# Altium project Transmitter.PrjPcb
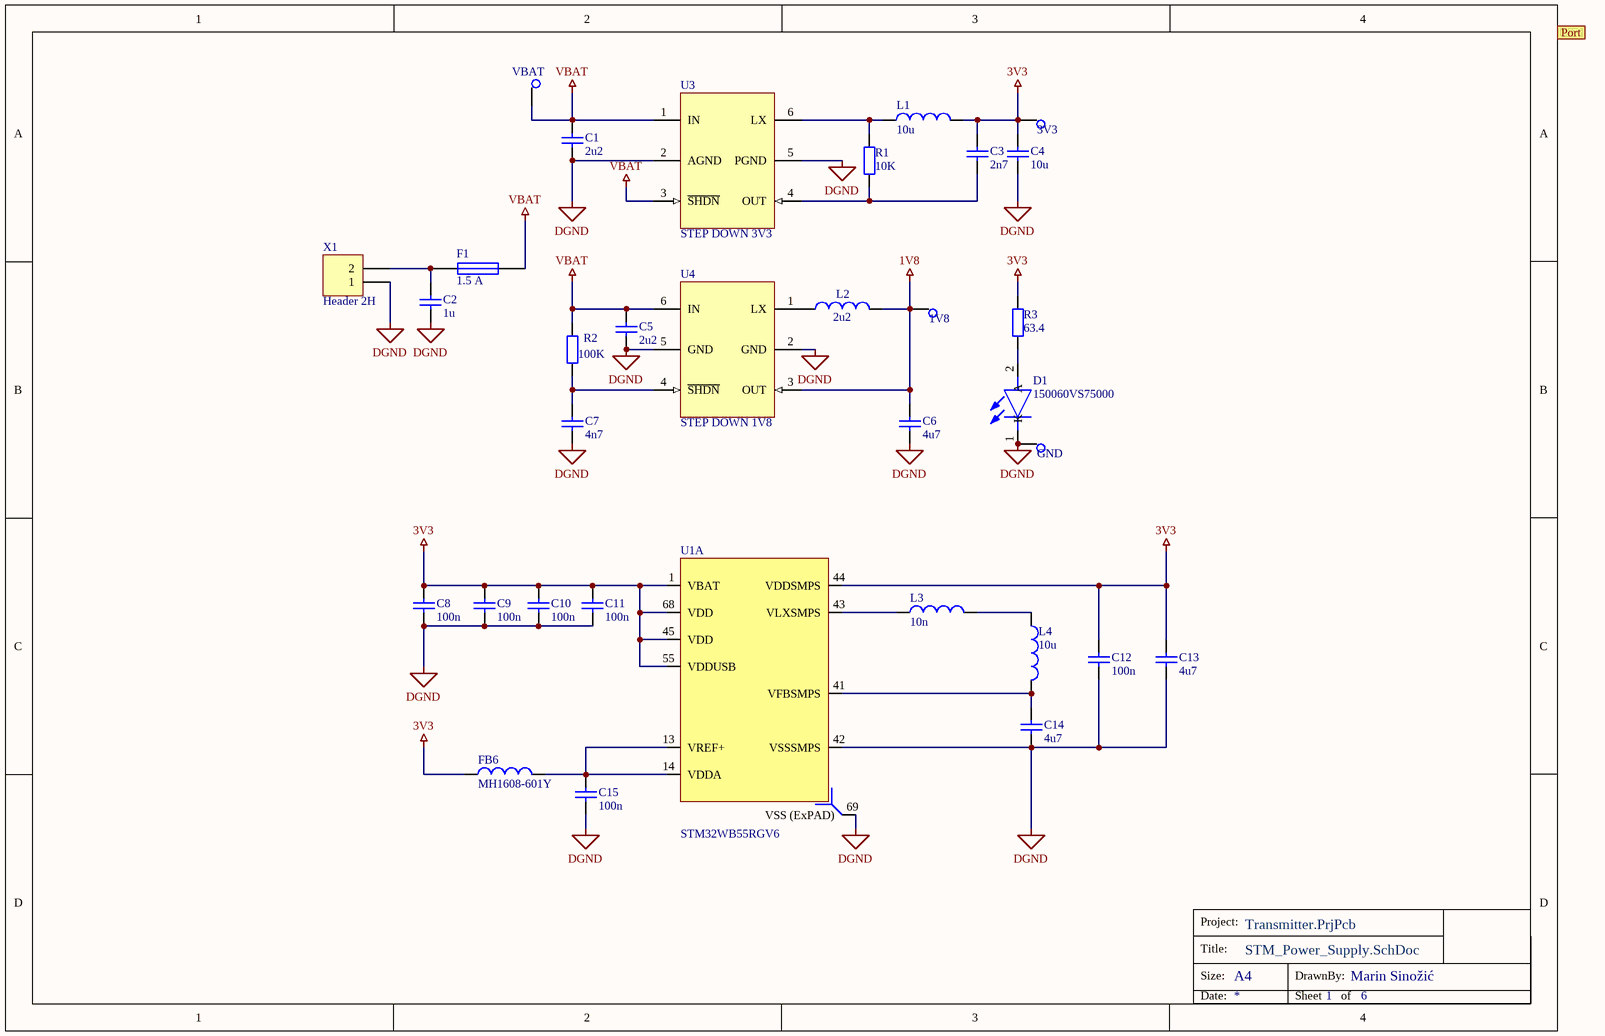
[diagram p0: STM_Power_Supply.SchDoc]
6 sheets, 129 parts. Net scope: global (net labels, ports and power ports of the same name join across sheets).
Board file: Transmitter.PcbDoc
Sheets:
  STM_Power_Supply.SchDoc
  STM_Bluetooth.SchDoc
  STM_DDS_GPIO.SchDoc
  DDS_Power_Supply.SchDoc
  DDS_Out.SchDoc
  Mechanical.SchDoc

## Sheet STM_Power_Supply.SchDoc: STM Power Supply
size A4; DrawnBy: Marin Sinožić; Organization: Altium Limited; Address1: L3, 12a Rodborough Rd; Address2: Frenchs Forest; Address3: NSW; Address4: Australia 2086; SheetNumber: 1; SheetTotal: 6

### Parts
1V8  TestPoint  [TP]  (value not drawn)
3V3  TestPoint  [TP]  (value not drawn)
C1  2u2  [0603]
C2  1u  [0805]
C3  2n7  [0603]
C4  10u  [0603]
C5  2u2  [0603]
C6  4u7  [0603]
C7  4n7  [0603]
C8  100n  [0603]
C9  100n  [0603]
C10  100n  [0603]
C11  100n  [0603]
C12  100n  [0603]
C13  4u7  [0603]
C14  4u7  [0603]
C15  100n  [0603]
D1  150060VS75000  [0603]
F1  1.5 A  [MF-USMF075-2]
FB6  MH1608-601Y  [0603]
GND  TestPoint  [TP]  (value not drawn)
L1  10u  [IND_10uH]
L2  2u2  [INDP2929X15N]
L3  10n  [0603]
L4  10u  [0805]
R1  10K  [0603]
R2  100K  [0603]
R3  63.4  [0603]
U1  STM32WB55RGV6  [VFQFPN69]  (part A of 3)
U3  STEP DOWN 3V3  [SOT95P280X145-6N]
U4  STEP DOWN 1V8  [SC70P20X21]
VBAT  TestPoint  [TP]  (value not drawn)
X1  Header 2H  [HDR1X2]

### Ports
Port

### Nets
1V8: 1V8.1 C6.2 L2.1 U4.3(OUT)
3V3: 3V3.1 C3.2 C4.2 C8.2 C9.2 C10.2 C11.2 C12.2 C13.1 FB6.1 L1.2 R3.2 U1.1(VBAT) U1.44(VDDSMPS) U1.45(VDD) U1.55(VDDUSB) U1.68(VDD)
DGND: C1.1 C2.1 C4.1 C5.1 C6.1 C7.1 C8.1 C9.1 C10.1 C11.1 C12.1 C13.2 C14.1 C15.1 D1.1(K) GND.1 U1.42(VSSSMPS) U1.69(VSS_(ExPAD)) U3.2(AGND) U3.5(PGND) U4.2(GND) U4.5(GND) X1.1
VBAT: C1.2 C5.2 F1.2 R2.2 U3.1(IN) U3.3(~{SHDN}) U4.6(IN) VBAT.1
NetC2_2: C2.2 F1.1 X1.2
NetC3_1: C3.1 R1.1 U3.4(OUT)
NetC7_2: C7.2 R2.1 U4.4(~{SHDN})
NetC14_2: C14.2 L4.2 U1.41(VFBSMPS)
NetC15_2: C15.2 FB6.2 U1.13(VREF+) U1.14(VDDA)
NetD1_2: D1.2(A) R3.1
NetL1_1: L1.1 R1.2 U3.6(LX)
NetL2_2: L2.2 U4.1(LX)
NetL3_1: L3.1 U1.43(VLXSMPS)
NetL3_2: L3.2 L4.1

### Notes on the sheet
- Project:
- Title:
- Size:
- A4
- DrawnBy:
- Date:
- Sheet
- of

### Library data of the parts
C1 C5 = Cap: CAP CER 2.2UF 25V X5R 0603; Manufacturer Part Number: 490-10731-1-ND; Value: 2u2; Supplier 1: Digi-Key; Price: 0.16
C2 = Cap: CAP CER 1UF 25V X5R 0805; Manufacturer Part Number: 311-1868-1-ND; Value: 1u; Supplier 1: Digi-Key; Price: 0.21
C3 = Cap: CAP CER 2700PF 50V X7R 0603; Manufacturer Part Number: 1276-2022-1-ND; Value: 2n7; Supplier 1: Digi-Key; Price: 0.1
C4 = Cap: CAP CER 10UF 25V X5R 0603; Manufacturer Part Number: 490-GRM188R61E106KA73JCT-ND; Value: 10u; Supplier 1: Digi-Key; Price: 0.32
C6 C13 C14 = Cap: CAP CER 4.7UF 16V X5R 0603; Manufacturer Part Number: 587-2786-1-ND; Value: 4u7; Supplier 1: Digi-Key; Price: 0.32
C7 = Cap: CAP CER 4700PF 50V X7R 0603; Manufacturer Part Number: 1276-1098-1-ND; Value: 4n7; Supplier 1: Digi-Key; Price: 0.1
C8-C12 C15 = Cap: CAP CER 0.1UF 50V X7R 0603; Manufacturer Part Number: 1276-CL10B104KB8WPNDCT-ND; Value: 100n; Supplier 1: Digi-Key; Price: 0.1
D1 = 150060VS75000: LED GREEN DIFFUSED 0603 SMD; Manufacturer Part Number: 732-12017-1-ND; Price: 0.18; Value: *; Supplier 1: Digi-Key
F1 = Fuse 1: PTC RESET FUSE 6V 750MA 1210; Manufacturer Part Number: MF-USMF075-2CT-ND; Price: 0.67; Supplier 1: Digi-Key
FB6 = MH1608-601Y: FERRITE BEAD 600 OHM 0603 1LN; Manufacturer Part Number: MH1608-601YCT-ND; Supplier 1: Digi-Key; Price: 0.1
L1 = L_0805_10uH: FIXED IND 10UH 550MA 210MOHM SMD; Manufacturer Part Number: 308-2298-1-ND; Supplier 1: Digi-Key; Value: 10u; Price: 1.23
L2 = L_0805_10uH: FIXED IND 2.2UH 1.22A 78MOHM SMD; Manufacturer Part Number: 490-15950-1-ND; Supplier 1: Digi-Key; Value: 2u2; Price: 0.36
L3 = L_0805_10uH: FIXED IND 10NH 600MA 200MOHM SMD; Manufacturer Part Number: 490-15244-1-ND; Supplier 1: Digi-Key; Value: 10n; Price: 0.14
L4 = L_0805_10uH: FIXED IND 10UH 100MA 780MOHM SMD; Manufacturer Part Number: 490-4029-1-ND; Supplier 1: Digi-Key; Value: 10u; Price: 0.25
R1 = Res2: RES SMD 10K OHM 0.5% 1/5W 0603; Manufacturer Part Number: P20397CT-ND; Value: 10K; Supplier 1: Digi-Key; Price: 0.16
R2 = Res2: RES 100 KOHMS 0.5% 1/10W 0603; Manufacturer Part Number: P123902CT-ND; Value: 100K; Supplier 1: Digi-Key; Price: 0.11
R3 = Res2: RES SMD 63.4 OHM 0.1% 1/10W 0603; Manufacturer Part Number: YAG4584CT-ND; Value: 63.4; Supplier 1: Digi-Key; Price: 0.32
U1 = STM32WB55RGV6: MCU 32-Bit STM32WB55 ARM Cortex M4 RISC 1MB Flash 1.7V to 3.6V 68-Pin VFQFPN Tray; Manufacturer Part Number: 497-18488-ND; Price: 11.67; Supplier 1: Digi-Key
U3 = MAX1921EUT33+T: IC REG BUCK 3.3V 400MA SOT23-6; Manufacturer Part Number: MAX1921EUT33+T-ND; Price: 3.34; Supplier 1: Digi-Key
U4 = MAX8640YEXT18+T: IC REG BUCK 1.8V 500MA SC70-6; Manufacturer Part Number: MAX8640YEXT18+TCT-ND; Price: 4.69; Supplier 1: Digi-Key
X1 = Header 2H: Header, 2-Pin, Right Angle

## Sheet STM_Bluetooth.SchDoc
size A4; DrawnBy: Marin Sinožić; SheetNumber: 2; SheetTotal: 6
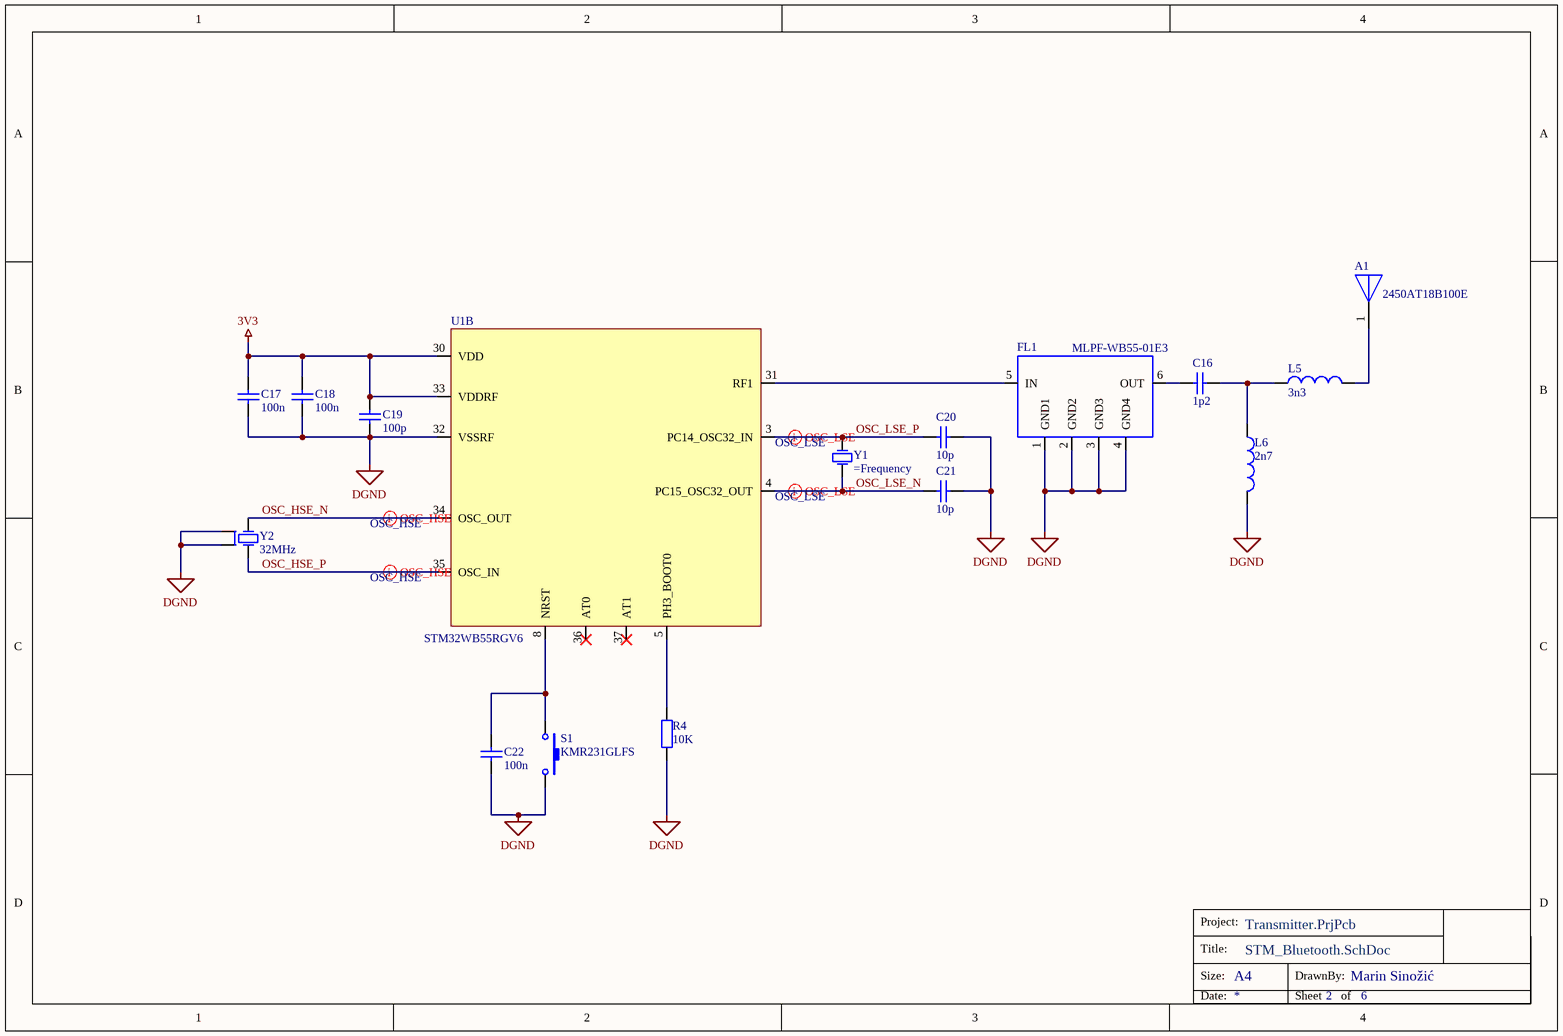
[diagram p1: STM_Bluetooth.SchDoc]

### Parts
A1  2450AT18B100E  [ANT_2450AT18B100E]
C16  1p2  [0402]
C17  100n  [0603]
C18  100n  [0603]
C19  100p  [0603]
C20  10p  [0603]
C21  10p  [0603]
C22  100n  [0603]
FL1  MLPF-WB55-01E3  [CSP_BUMPLESS]
L5  3n3  [0402]
L6  2n7  [0402]
R4  10K  [0603]
S1  KMR231GLFS  [SW-PB SMD KMR2]
U1  STM32WB55RGV6  [Model Name]  (part B of 3)
Y1  (no value)  [NX2012_2P]
Y2  32MHz  [NX2016_4P]

### Nets
3V3: C17.2 C18.2 C19.2 U1.30(VDD) U1.33(VDDRF)
DGND: C17.1 C18.1 C19.1 C20.2 C21.2 C22.1 FL1.1(GND1) FL1.2(GND2) FL1.3(GND3) FL1.4(GND4) L6.2 R4.1 S1.2 U1.32(VSSRF) Y2.2 Y2.4
OSC_HSE_N: U1.34(OSC_OUT) Y2.1(OSC1)
OSC_HSE_P: U1.35(OSC_IN) Y2.3(OSC2)
OSC_LSE_N: C21.1 U1.4(PC15_OSC32_OUT) Y1.1(OSC1)
OSC_LSE_P: C20.1 U1.3(PC14_OSC32_IN) Y1.2(OSC2)
NetA1_1: A1.1 L5.2
NetC16_1: C16.1 L5.1 L6.1
NetC16_2: C16.2 FL1.6(OUT)
NetC22_2: C22.2 S1.1 U1.8(NRST)
NetFL1_5: FL1.5(IN) U1.31(RF1)
NetR4_2: R4.2 U1.5(PH3_BOOT0)

Not connected (* = marked no-connect by the designer): U1 36(AT0)* 37(AT1)*

### Layout directives
differential pair; differential pair class OSC_LSE; net class *: OSC_LSE_P
differential pair; differential pair class OSC_LSE: OSC_LSE_N
differential pair; differential pair class OSC_HSE: OSC_HSE_N
differential pair; differential pair class OSC_HSE; differential pair class OSC_HSE: OSC_HSE_P

### Notes on the sheet
- Project:
- Title:
- Size:
- A4
- DrawnBy:
- Date:
- Sheet
- of

### Library data of the parts
A1 = BT_ANTENNA: RF ANT 2.4GHZ CHIP SOLDER SMD; Manufacturer Part Number: 712-1006-1-ND; Supplier 1: Digi-Key; Price: 0.56
C16 = Cap: CAP CER 1.2PF 50V C0G/NP0 0402; Manufacturer Part Number: 712-1268-1-ND; Value: 1p2; Supplier 1: Digi-Key; Price: 0.18
C17 C18 C22 = Cap: as C8 on sheet STM_Power_Supply; Value: 100n; Supplier 1: Digi-Key; Price: 0.1
C19 = Cap: CAP CER 100PF 50V X7R 0603; Manufacturer Part Number: 1276-1908-1-ND; Value: 100p; Supplier 1: Digi-Key; Price: 0.1
C20 C21 = Cap: CAP CER 10PF 50V X7R 0603; Manufacturer Part Number: 399-C0603C100J5RAC7867CT-ND; Value: 10p; Supplier 1: Digi-Key; Price: 0.25
FL1 = FLT_2.4GHz: RF Filter Low Pass 2400MHz to 2500MHz 1.1dB 50Ohm SMD 6Pin T/R; Supplier 1: Digi-Key; Manufacturer Part Number: MLPF-WB55-01E3; Price: 0.39
L5 = L_0805_10uH: FIXED IND 3.3NH 300MA 190MOHM SM; Manufacturer Part Number: 712-1416-1-ND; Supplier 1: Digi-Key; Value: 3n3; Price: 0.1
L6 = L_0805_10uH: FIXED IND 2.7NH 300MA 170MOHM SM; Manufacturer Part Number: 712-1415-1-ND; Supplier 1: Digi-Key; Value: 2n7; Price: 0.1
R4 = Res2: as R1 on sheet STM_Power_Supply; Value: 10K; Supplier 1: Digi-Key; Price: 0.16
S1 = SW-PB: Switch Tactile N.O. SPST Button Gull Wing 0.05A 32VDC 1VA 150000Cycles 3N SMD T/R; Manufacturer Part Number: 1437636; Supplier 1: Farnell; Price: 0,49
U1 = STM32WB55RGV6: MCU 32-Bit STM32WB55 ARM Cortex M4 RISC 1MB Flash 1.7V to 3.6V 68-Pin VFQFPN Tray
Y1 = OSC_LFXTAL073170_32.768kHz: NDK 32.76kHz Crystal Unit ±20ppm SMD 2-Pin 2.05 x 1.2 x 0.55mm; Manufacturer Part Number: 644-1219-1-ND; Supplier 1: Digi-Key; Price: 0.91
Y2 = OSC_LFXTAL073170_32MHz: Crystal 32.0MHZ 10PF SMD Esr 60; Manufacturer Part Number: 1923-1603-1-ND; Supplier 1: Digi-Key; Price: 0.66

## Sheet STM_DDS_GPIO.SchDoc: STM DDS GPIO
size A4; DrawnBy: Marin Sinožić; SheetNumber: 3; SheetTotal: 6
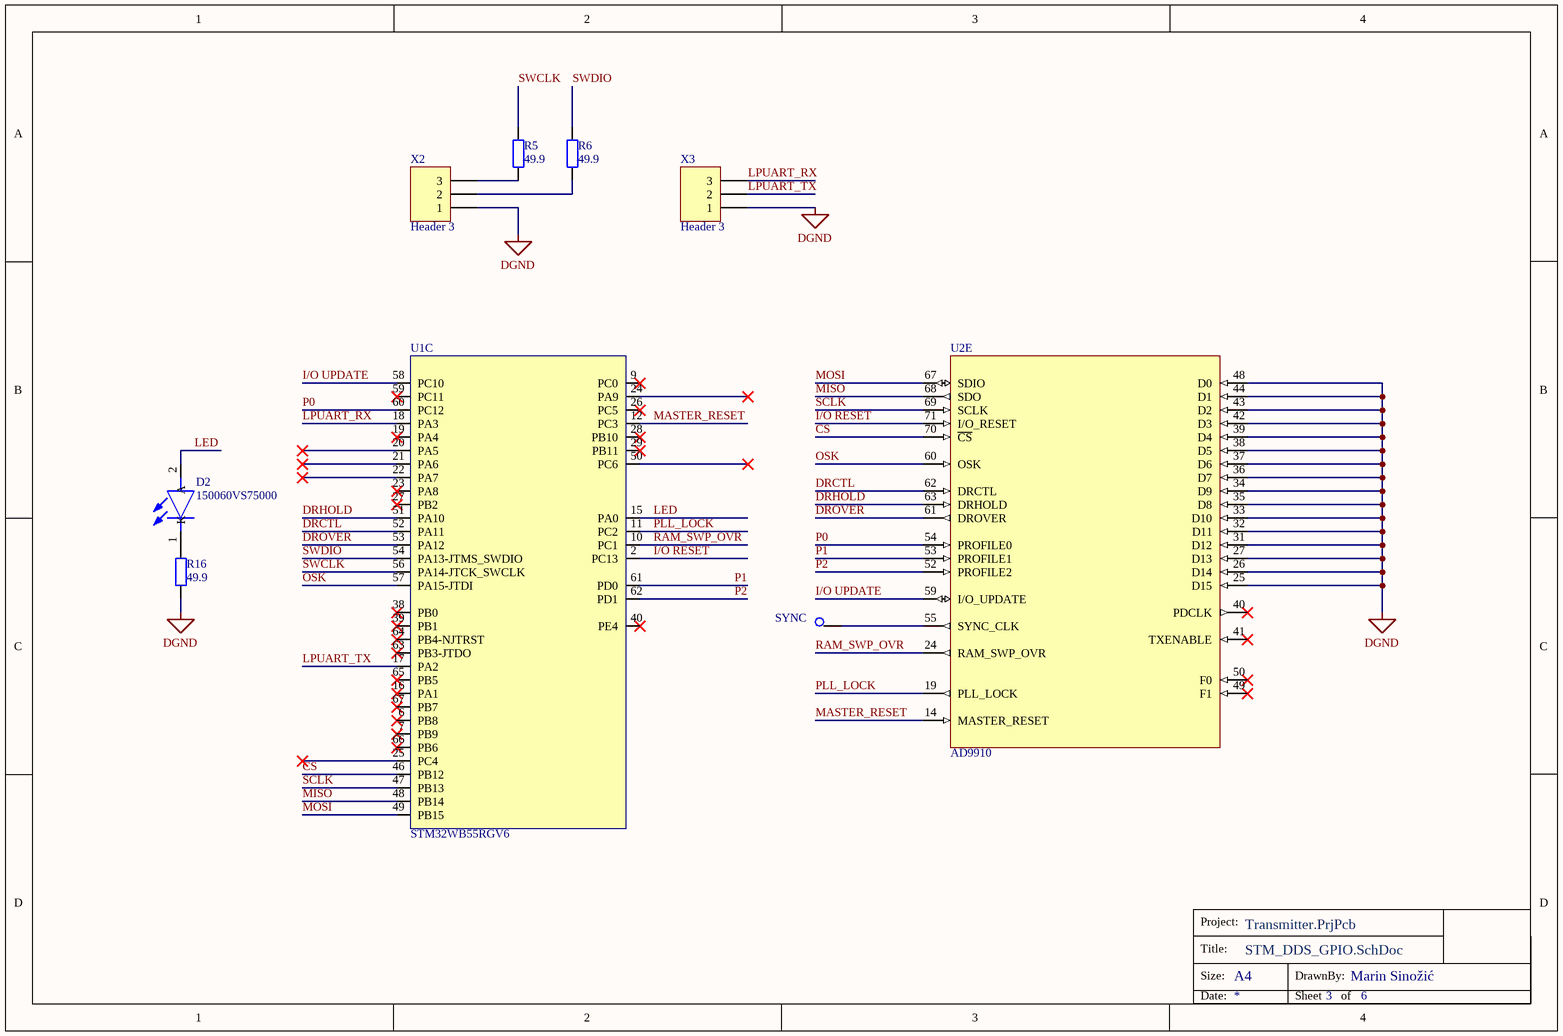
[diagram p2: STM_DDS_GPIO.SchDoc]

### Parts
D2  150060VS75000  [0603]
R5  49.9  [0805]
R6  49.9  [0805]
R16  49.9  [0805]
SYNC  TestPoint  [TP]  (value not drawn)
U1  STM32WB55RGV6  [VFQFPN69]  (part C of 3)
U2  AD9910  [TSQFP50P1600X1600X105_HS-101N]  (part E of 5)
X2  Header 3  [HDR1X3]
X3  Header 3  [HDR1X3]

### Nets
DGND: R16.2 U2.25(D15) U2.26(D14) U2.27(D13) U2.31(D12) U2.32(D11) U2.33(D10) U2.34(D9) U2.35(D8) U2.36(D7) U2.37(D6) U2.38(D5) U2.39(D4) U2.42(D3) U2.43(D2) U2.44(D1) U2.48(D0) X2.1 X3.1
~{CS}: U1.46(PB12) U2.70(~{CS})
DRCTL: U1.52(PA11) U2.62(DRCTL)
DRHOLD: U1.51(PA10) U2.63(DRHOLD)
DROVER: U1.53(PA12) U2.61(DROVER)
I/O RESET: U1.2(PC13) U2.71(I/O_RESET)
I/O UPDATE: U1.58(PC10) U2.59(I/O_UPDATE)
LED: D2.2(A) U1.15(PA0)
LPUART_RX: U1.18(PA3) X3.3
LPUART_TX: U1.17(PA2) X3.2
MASTER_RESET: U1.12(PC3) U2.14(MASTER_RESET)
MISO: U1.48(PB14) U2.68(SDO)
MOSI: U1.49(PB15) U2.67(SDIO)
OSK: U1.57(PA15-JTDI) U2.60(OSK)
P0: U1.60(PC12) U2.54(PROFILE0)
P1: U1.61(PD0) U2.53(PROFILE1)
P2: U1.62(PD1) U2.52(PROFILE2)
PLL_LOCK: U1.11(PC2) U2.19(PLL_LOCK)
RAM_SWP_OVR: U1.10(PC1) U2.24(RAM_SWP_OVR)
SCLK: U1.47(PB13) U2.69(SCLK)
SWCLK: R5.1 U1.56(PA14-JTCK_SWCLK)
SWDIO: R6.1 U1.54(PA13-JTMS_SWDIO)
NetD2_1: D2.1(K) R16.1
NetR5_2: R5.2 X2.3
NetR6_2: R6.2 X2.2
NetSYNC_1: SYNC.1 U2.55(SYNC_CLK)

Not connected (* = marked no-connect by the designer): U1 6(PB8)* 7(PB9)* 9(PC0)* 16(PA1)* 19(PA4)* 20(PA5)* 21(PA6)* 22(PA7)* 23(PA8)* 24(PA9)* 25(PC4)* 26(PC5)* 27(PB2)* 28(PB10)* 29(PB11)* 38(PB0)* 39(PB1)* 40(PE4)* 50(PC6)* 59(PC11)* 63(PB3-JTDO)* 64(PB4-NJTRST)* 65(PB5)* 66(PB6)* 67(PB7)*; U2 40(PDCLK)* 41(TXENABLE)* 49(F1)* 50(F0)*

### Notes on the sheet
- Project:
- Title:
- Size:
- A4
- DrawnBy:
- Date:
- Sheet
- of

### Library data of the parts
D2 = 150060VS75000: as D1 on sheet STM_Power_Supply; Price: 0.18; Value: *; Supplier 1: Digi-Key
R5 R6 R16 = Res2: RES SMD 49.9 OHM 0.1% 1/10W 0603; Manufacturer Part Number: P49.9DBCT-ND; Value: 49.9; Supplier 1: Digi-Key; Price: 0.32
U1 = STM32WB55RGV6: as U1 on sheet STM_Power_Supply; Price: 11.67; Supplier 1: Digi-Key
U2 = AD9910BSVZ: ANALOG DEVICES - AD9910BSVZ - Direct Digital Synthesizer, 1 GSPS. 14 Bit, 3.3 V,; Manufacturer Part Number: 505-AD9910BSVZ-ND; Price: 72.64; Supplier 1: Digi-Key
X2 X3 = Header 3: Header, 3-Pin

## Sheet DDS_Power_Supply.SchDoc
size A4; DrawnBy: Marin Sinožić; SheetNumber: 4; SheetTotal: 6
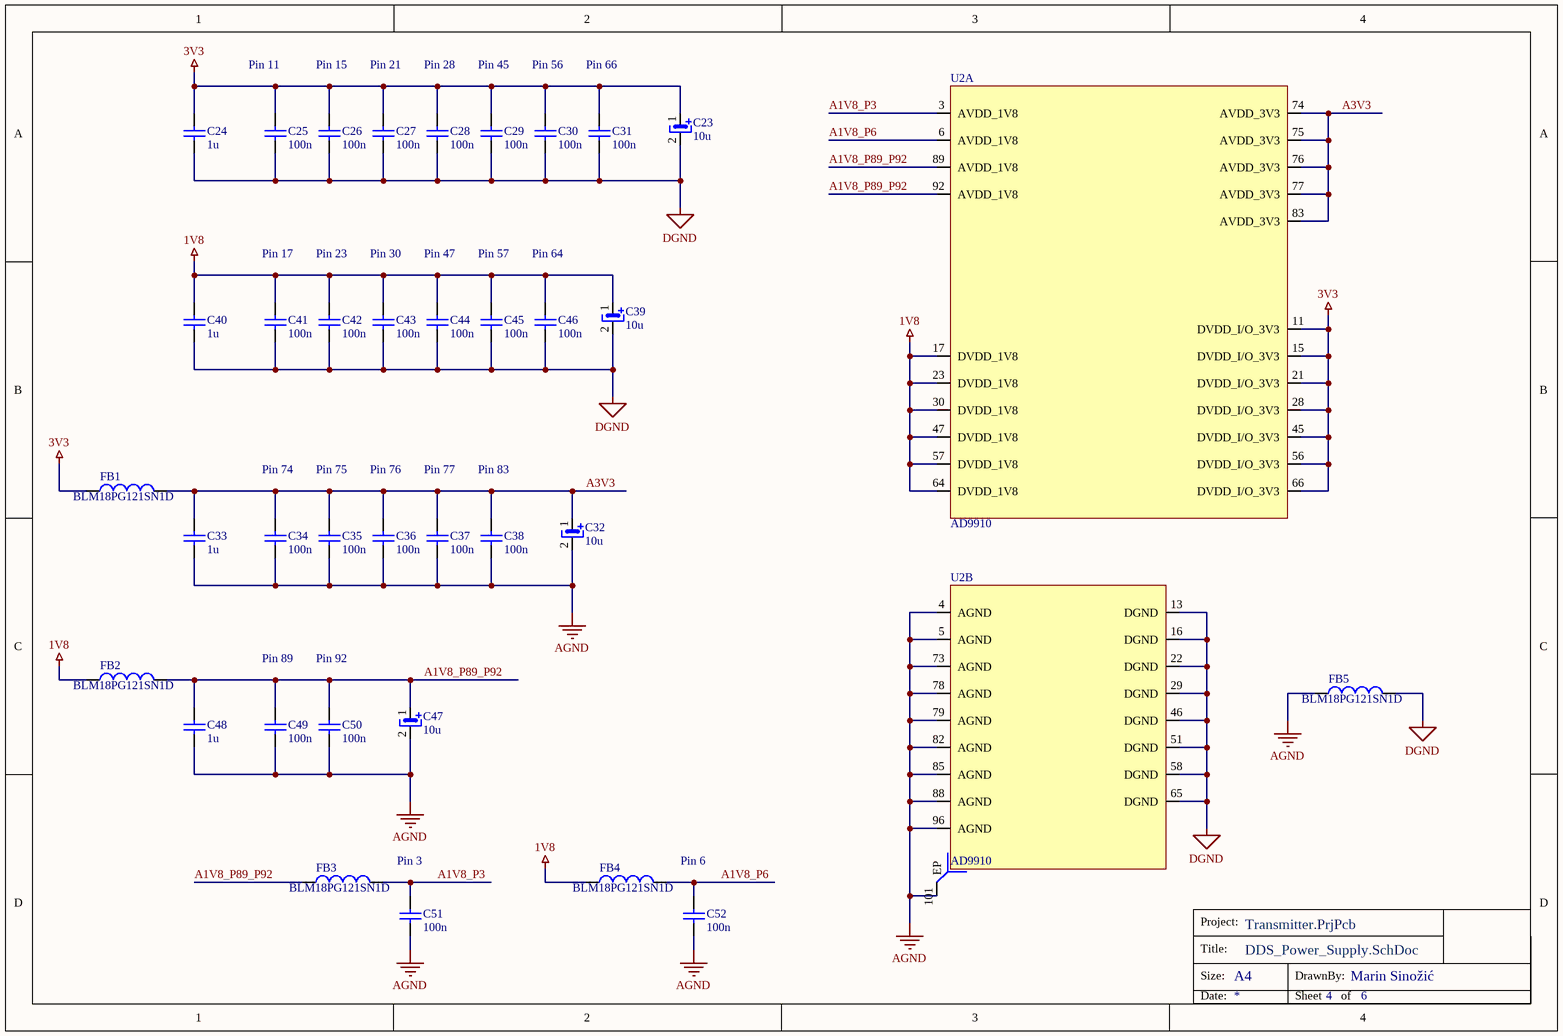
[diagram p3: DDS_Power_Supply.SchDoc]

### Parts
C23  10u  [0805]
C24  1u  [0805]
C25  100n  [0603]
C26  100n  [0603]
C27  100n  [0603]
C28  100n  [0603]
C29  100n  [0603]
C30  100n  [0603]
C31  100n  [0603]
C32  10u  [0805]
C33  1u  [0805]
C34  100n  [0603]
C35  100n  [0603]
C36  100n  [0603]
C37  100n  [0603]
C38  100n  [0603]
C39  10u  [0805]
C40  1u  [0805]
C41  100n  [0603]
C42  100n  [0603]
C43  100n  [0603]
C44  100n  [0603]
C45  100n  [0603]
C46  100n  [0603]
C47  10u  [0805]
C48  1u  [0805]
C49  100n  [0603]
C50  100n  [0603]
C51  100n  [0603]
C52  100n  [0603]
FB1  BLM18PG121SN1D  [0603]
FB2  BLM18PG121SN1D  [0603]
FB3  BLM18PG121SN1D  [0603]
FB4  BLM18PG121SN1D  [0603]
FB5  BLM18PG121SN1D  [0603]
U2  AD9910  [TSQFP50P1600X1600X105_HS-101N]  (parts A,B of 5)

### Nets
1V8: C39.1(+) C40.2 C41.2 C42.2 C43.2 C44.2 C45.2 C46.2 FB2.1 FB4.1 U2.17(DVDD_1V8) U2.23(DVDD_1V8) U2.30(DVDD_1V8) U2.47(DVDD_1V8) U2.57(DVDD_1V8) U2.64(DVDD_1V8)
3V3: C23.1(+) C24.2 C25.2 C26.2 C27.2 C28.2 C29.2 C30.2 C31.2 FB1.1 U2.11(DVDD_I/O_3V3) U2.15(DVDD_I/O_3V3) U2.21(DVDD_I/O_3V3) U2.28(DVDD_I/O_3V3) U2.45(DVDD_I/O_3V3) U2.56(DVDD_I/O_3V3) U2.66(DVDD_I/O_3V3)
AGND: C32.2(-) C33.1 C34.1 C35.1 C36.1 C37.1 C38.1 C47.2(-) C48.1 C49.1 C50.1 C51.1 C52.1 FB5.1 U2.4(AGND) U2.5(AGND) U2.73(AGND) U2.78(AGND) U2.79(AGND) U2.82(AGND) U2.85(AGND) U2.88(AGND) U2.96(AGND) U2.101(EP)
DGND: C23.2(-) C24.1 C25.1 C26.1 C27.1 C28.1 C29.1 C30.1 C31.1 C39.2(-) C40.1 C41.1 C42.1 C43.1 C44.1 C45.1 C46.1 FB5.2 U2.13(DGND) U2.16(DGND) U2.22(DGND) U2.29(DGND) U2.46(DGND) U2.51(DGND) U2.58(DGND) U2.65(DGND)
A1V8_P3: C51.2 FB3.2 U2.3(AVDD_1V8)
A1V8_P6: C52.2 FB4.2 U2.6(AVDD_1V8)
A1V8_P89_P92: C47.1(+) C48.2 C49.2 C50.2 FB2.2 FB3.1 U2.89(AVDD_1V8) U2.92(AVDD_1V8)
A3V3: C32.1(+) C33.2 C34.2 C35.2 C36.2 C37.2 C38.2 FB1.2 U2.74(AVDD_3V3) U2.75(AVDD_3V3) U2.76(AVDD_3V3) U2.77(AVDD_3V3) U2.83(AVDD_3V3)

### Notes on the sheet
- Pin 11
- Pin 15
- Pin 21
- Pin 28
- Pin 45
- Pin 56
- Pin 66
- Pin 17
- Pin 23
- Pin 30
- Pin 47
- Pin 57
- Pin 64
- Pin 74
- Pin 75
- Pin 76
- Pin 77
- Pin 83
- Pin 89
- Pin 92
- Pin 3
- Pin 6
- Project:
- Title:
- Size:
- A4
- DrawnBy:
- Date:
- Sheet
- of

### Library data of the parts
C23 C32 C39 C47 = C_TANT_10uF: CAP TANT 10UF 20% 10V 0805; Manufacturer Part Number: 718-2490-1-ND; Supplier 1: Digi-Key; Capacitance: 10uF; Price: 0.36; Value: 10u
C24 C33 C40 C48 = Cap: as C2 on sheet STM_Power_Supply; Value: 1u; Supplier 1: Digi-Key; Price: 0.21
C25-C31 C34-C38 C41-C46 C49-C52 = Cap: as C8 on sheet STM_Power_Supply; Value: 100n; Supplier 1: Digi-Key; Price: 0.1
FB1-FB5 = FB_0603_120R@100MHz: FERRITE BEAD 120 OHM 0603 1LN; Manufacturer Part Number: 490-1037-1-ND; Supplier 1: Digi-Key; Price: 0.1
U2 = AD9910BSVZ: as U2 on sheet STM_DDS_GPIO; Price: 72.64; Supplier 1: Digi-Key

## Sheet DDS_Out.SchDoc
size A4; DrawnBy: Marin Sinožić; SheetNumber: 5; SheetTotal: 6
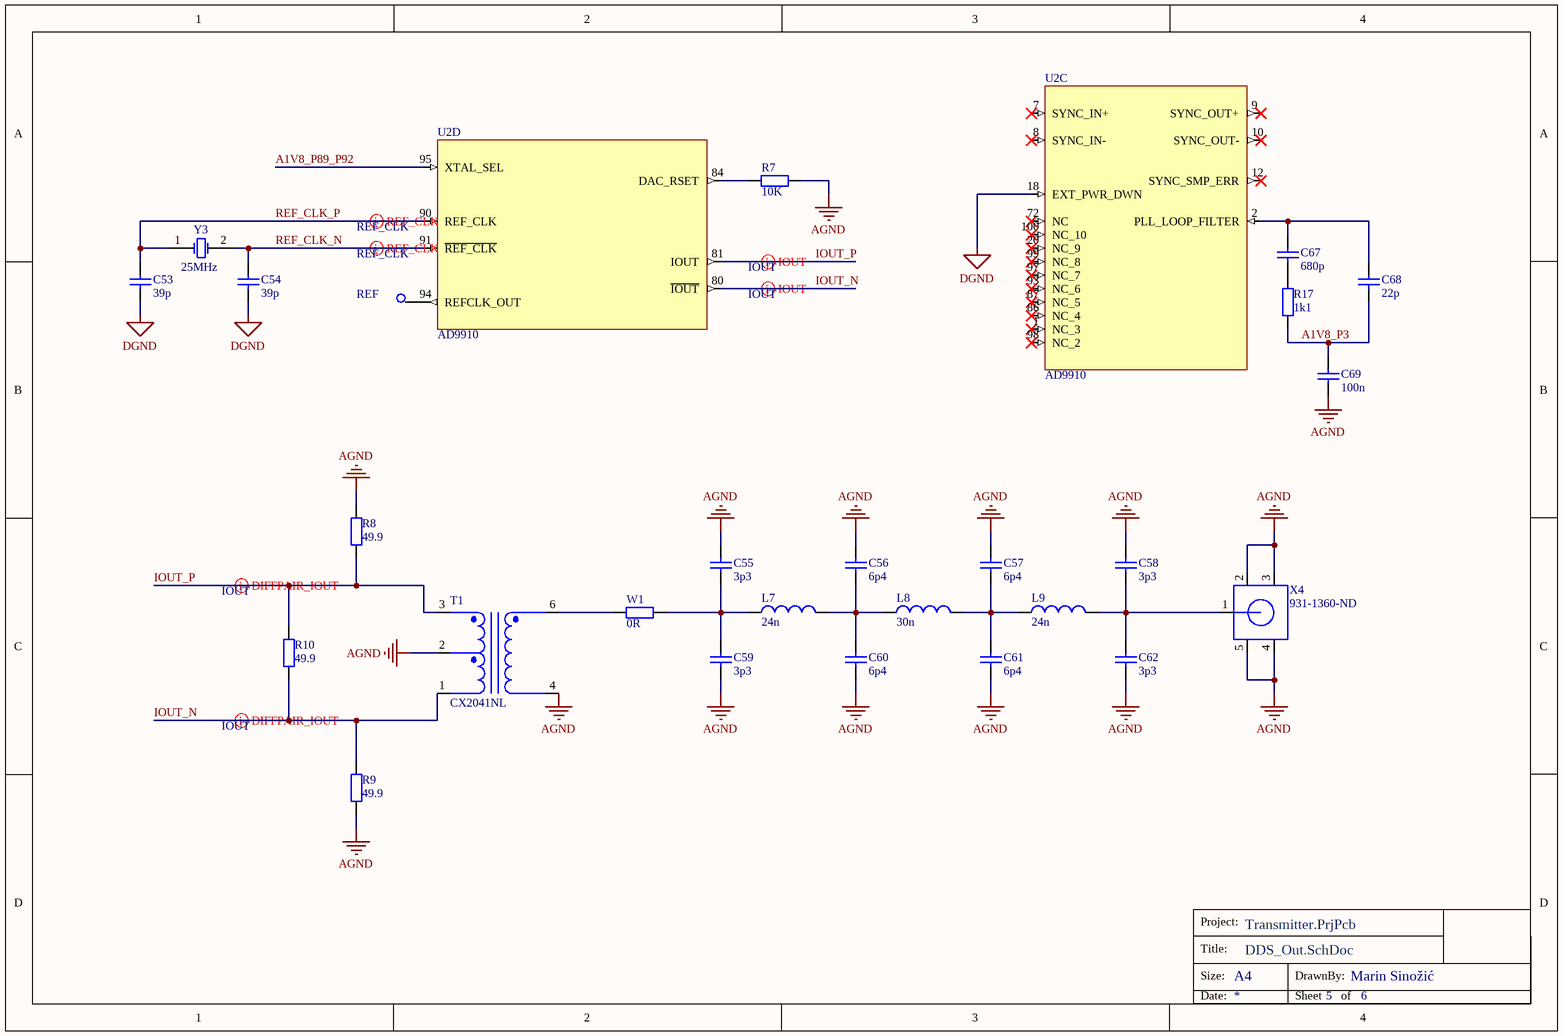
[diagram p4: DDS_Out.SchDoc]

### Parts
C53  39p  [0603]
C54  39p  [0603]
C55  3p3  [0603]
C56  6p4  [0603]
C57  6p4  [0603]
C58  3p3  [0603]
C59  3p3  [0603]
C60  6p4  [0603]
C61  6p4  [0603]
C62  3p3  [0603]
C67  680p  [0603]
C68  22p  [0603]
C69  100n  [0603]
L7  24n  [0603]
L8  30n  [0603]
L9  24n  [0603]
R7  10K  [0603]
R8  49.9  [0805]
R9  49.9  [0805]
R10  49.9  [0805]
R17  Resistance: 1k1  [0603]  (hidden comment: TBD)
REF  TestPoint  [TP]  (value not drawn)
T1  CX2041NL  [RF_TRANSF]
U2  AD9910  [TSQFP50P1600X1600X105_HS-101N]  (parts C,D of 5)
W1  0R  [0603]
X4  931-1360-ND  [SMA]
Y3  25MHz  [XTAL_ECS-196-S-23A-TR]

### Nets
AGND: C55.2 C56.2 C57.2 C58.2 C59.1 C60.1 C61.1 C62.1 C69.1 R7.1 R8.1 R9.2 T1.2 T1.4 X4.2(GND) X4.3(GND) X4.4(GND) X4.5(GND)
DGND: C53.1 C54.1 U2.18(EXT_PWR_DWN)
A1V8_P3: C68.1 C69.2 R17.2
A1V8_P89_P92: U2.95(XTAL_SEL)
IOUT_N: R9.1 R10.2 T1.1 U2.80(~{IOUT})
IOUT_P: R8.2 R10.1 T1.3 U2.81(IOUT)
REF_CLK_N: C54.2 U2.91(~{REF_CLK}) Y3.2(OSC2)
REF_CLK_P: C53.2 U2.90(REF_CLK) Y3.1(OSC1)
NetC55_1: C55.1 C59.2 L7.1 W1.2
NetC56_1: C56.1 C60.2 L7.2 L8.1
NetC57_1: C57.1 C61.2 L8.2 L9.1
NetC58_1: C58.1 C62.2 L9.2 X4.1(OUT)
NetC67_1: C67.1 R17.1
NetC67_2: C67.2 C68.2 U2.2(PLL_LOOP_FILTER)
NetR7_2: R7.2 U2.84(DAC_RSET)
NetREF_1: REF.1 U2.94(REFCLK_OUT)
NetT1_6: T1.6 W1.1

Not connected (* = marked no-connect by the designer): U2 1(NC_3)* 7(SYNC_IN+)* 8(SYNC_IN-)* 9(SYNC_OUT+)* 10(SYNC_OUT-)* 12(SYNC_SMP_ERR)* 20(NC_9)* 72(NC)* 86(NC_4)* 87(NC_5)* 93(NC_6)* 97(NC_7)* 98(NC_2)* 99(NC_8)* 100(NC_10)*

### Layout directives
differential pair; differential pair class IOUT: IOUT_N, IOUT_P
differential pair; differential pair class REF_CLK; rule Matched Net Lengths [Tolerance = 0.01mm]: REF_CLK_P
differential pair; differential pair class REF_CLK: REF_CLK_N

### Notes on the sheet
- Project:
- Title:
- Size:
- A4
- DrawnBy:
- Date:
- Sheet
- of

### Library data of the parts
C53 C54 = Cap: CAP CER 39PF 50V C0G/NP0 0603; Manufacturer Part Number: 720-VJ0603A390GXACW1BCCT-ND; Value: 39p; Supplier 1: Digi-Key; Price: 0.15
C55 C58 C59 C62 = C_0402_3.3pF: CAP CER 3.3PF 50V C0G/NPO 0603; Manufacturer Part Number: 311-3832-1-ND; Supplier 1: Digi-Key; Capacitance: 3.3pF; Price: 0.11; Value: 3p3
C56 C57 C60 C61 C67-C69 = C_0402_6.8pF: CAP CER RF 6.4PF 50V +/-0.1 PF C; Manufacturer Part Number: 399-16225-1-ND; Supplier 1: Digi-Key; Price: 0.30
  C56 C57 C60 C61: Capacitance: 6.4pF; Value: 6p4
  C67: Capacitance: 680p; Value: 680p
  C68: Capacitance: 6.4pF; Value: 22p
  C69: Capacitance: 6.4pF; Value: 100n
L7 L9 = L_0402_24nH: FIXED IND 24NH 500MA 210MOHM SMD; Manufacturer Part Number: 490-6877-1-ND; Supplier 1: Digi-Key; Inductance: 24nH; Price: 0.18; Value: 24n
L8 = L_0402_30nH: FIXED IND 30NH 600MA 144MOHM SMD; Manufacturer Part Number: 490-15816-1-ND; Supplier 1: Digi-Key; Inductance: 30nH; Price: 0.25; Value: 30n
R7 = Res2: as R1 on sheet STM_Power_Supply; Value: 10K; Supplier 1: Digi-Key; Price: 0.16
R8-R10 = Res2: as R5 on sheet STM_DDS_GPIO; Value: 49.9; Supplier 1: Digi-Key; Price: 0.32
R17 W1 = R_0603_0ohm: RES SMD 0 OHM JUMPER 1/3W 0603; Manufacturer Part Number: 541-0.0SBCT-ND; Supplier 1: Digi-Key; Price: 0.14
  W1: Resistance: 0R
T1 = RF_TRANSF: BALUN 50KHZ-450MHZ 75/75 5SMD; Manufacturer Part Number: 553-3187-ND; Supplier 1: Digi-Key; Price: 2.91
U2 = AD9910BSVZ: as U2 on sheet STM_DDS_GPIO; Price: 72.64; Supplier 1: Digi-Key
X4 = SMA_JACK: CONN RP-SMA JACK R/A 50 OHM PCB; Supplier 1: Digi-Key; Manufacturer Part Number: 931-1360-ND; Price: 3.10
Y3 = XTAL: Crystal 25.0MHZ 20PF SMD; Manufacturer Part Number: 50-ECS-250-20-23A-EN-TRCT-ND; Price: 1.01; Supplier 1: Digi-Key

## Sheet Mechanical.SchDoc
size A4; DrawnBy: Marin Sinožić; SheetNumber: 6; SheetTotal: 6
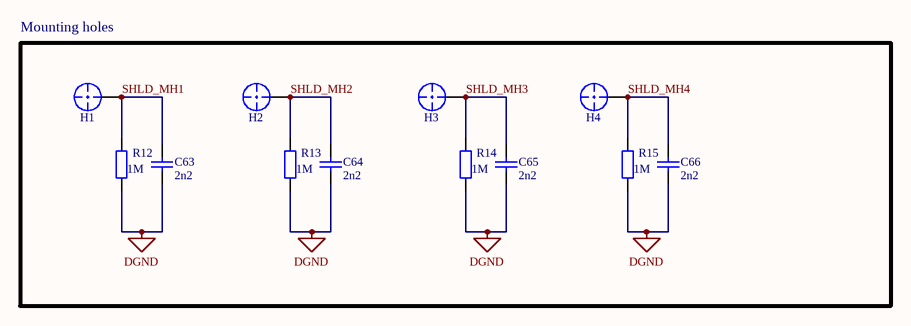
[diagram p5: Mechanical.SchDoc]

### Parts
C63  2n2  [0603]
C64  2n2  [0603]
C65  2n2  [0603]
C66  2n2  [0603]
H1  Hole_Mount  [HoleMount]  (value not drawn)
H2  Hole_Mount  [HoleMount]  (value not drawn)
H3  Hole_Mount  [HoleMount]  (value not drawn)
H4  Hole_Mount  [HoleMount]  (value not drawn)
R12  1M  [0603]
R13  1M  [0603]
R14  1M  [0603]
R15  1M  [0603]

### Blocks framed on the sheet
Mounting holes: C63-C66 H1-H4 R12-R15

### Nets
DGND: C63.1 C64.1 C65.1 C66.1 R12.1 R13.1 R14.1 R15.1
SHLD_MH1: C63.2 H1.1(CONNECT_TO) R12.2
SHLD_MH2: C64.2 H2.1(CONNECT_TO) R13.2
SHLD_MH3: C65.2 H3.1(CONNECT_TO) R14.2
SHLD_MH4: C66.2 H4.1(CONNECT_TO) R15.2

### Notes on the sheet
- Project:
- Title:
- Size:
- A4
- DrawnBy:
- Date:
- Sheet
- of

### Library data of the parts
C63-C66 = Cap: as C53 on sheet DDS_Out; Value: 2n2; Supplier 1: Digi-Key; Price: 0.15
R12-R15 = Res2: as R2 on sheet STM_Power_Supply; Value: 1M; Supplier 1: Digi-Key; Price: 0.11

## Nets that join several sheets
1V8: STM_Power_Supply (1V8.1 C6.2 L2.1 U4.3), DDS_Power_Supply (16 pins)
3V3: STM_Power_Supply (17 pins), STM_Bluetooth (5 pins), DDS_Power_Supply (17 pins)
AGND: DDS_Power_Supply (24 pins), DDS_Out (18 pins)
DGND: STM_Power_Supply (23 pins), STM_Bluetooth (16 pins), STM_DDS_GPIO (19 pins), DDS_Power_Supply (26 pins), DDS_Out (C53.1 C54.1 U2.18), Mechanical (8 pins)
A1V8_P3: DDS_Power_Supply (C51.2 FB3.2 U2.3), DDS_Out (C68.1 C69.2 R17.2)
A1V8_P89_P92: DDS_Power_Supply (8 pins), DDS_Out (U2.95)